# EasyEDA schematic Schemactic_LEDspot.json
TITLE: tiny_LEDspot; REV: 1.0; Date: 2019-06-21; Sheet: 1/1; Drawn By: julfi; Company: weldybox
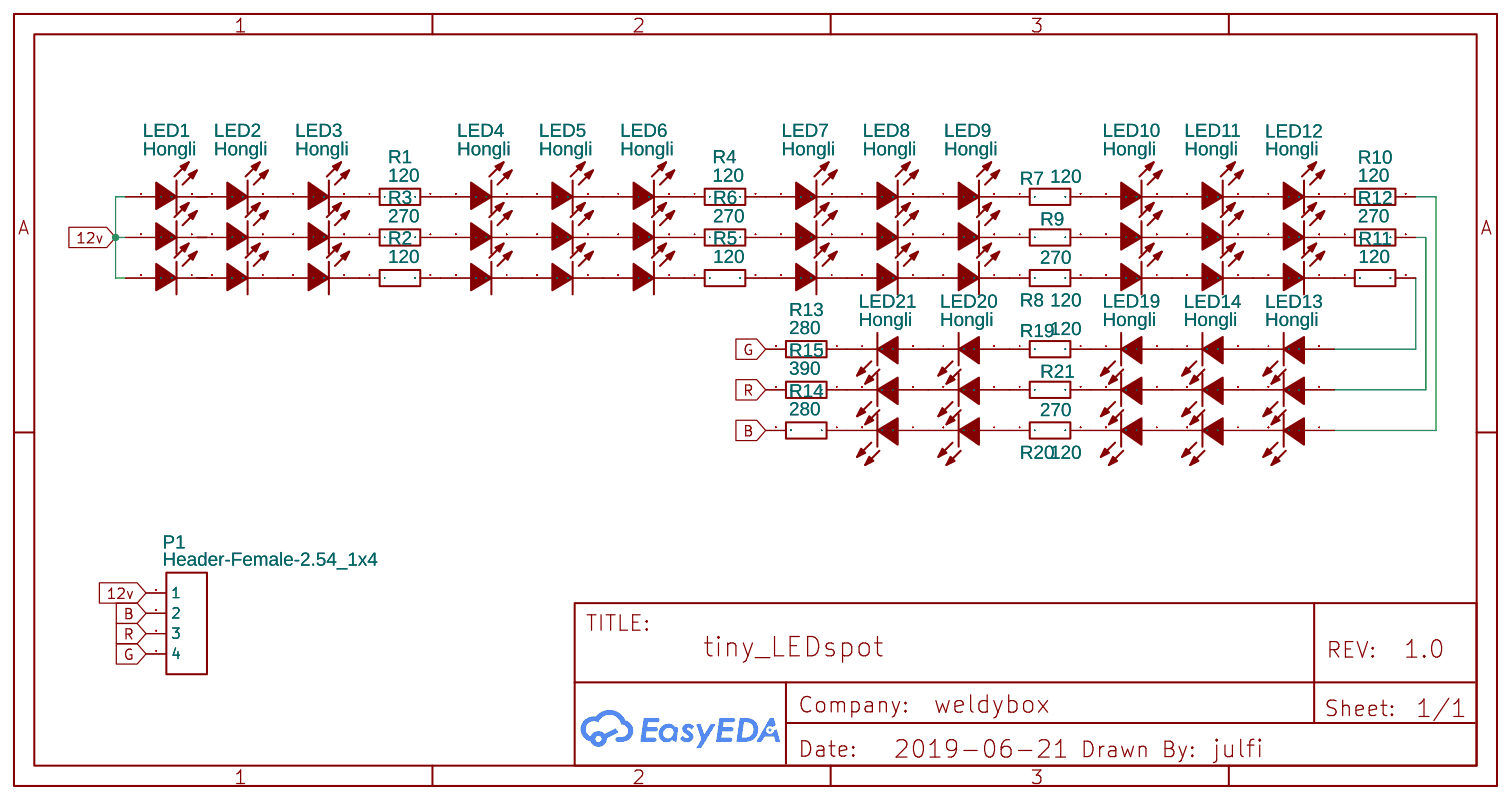
[diagram p0: schematic sheet]

## Parts
LED1  Hongli  [LED-SMD-5060]
LED2  Hongli  [LED-SMD-5060]
LED3  Hongli  [LED-SMD-5060]
LED4  Hongli  [LED-SMD-5060]
LED5  Hongli  [LED-SMD-5060]
LED6  Hongli  [LED-SMD-5060]
LED7  Hongli  [LED-SMD-5060]
LED8  Hongli  [LED-SMD-5060]
LED9  Hongli  [LED-SMD-5060]
LED10  Hongli  [LED-SMD-5060]
LED11  Hongli  [LED-SMD-5060]
LED12  Hongli  [LED-SMD-5060]
LED13  Hongli  [LED-SMD-5060]
LED14  Hongli  [LED-SMD-5060]
LED19  Hongli  [LED-SMD-5060]
LED20  Hongli  [LED-SMD-5060]
LED21  Hongli  [LED-SMD-5060]
P1  Header-Female-2.54_1x4  [HDR-4X1/2.54]
R1  120  [0805]
R2  120  [0805]
R3  270  [0805]
R4  120  [0805]
R5  120  [0805]
R6  270  [0805]
R7  120  [0805]
R8  120  [0805]
R9  270  [0805]
R10  120  [0805]
R11  120  [0805]
R12  270  [0805]
R13  280  [0805]
R14  280  [0805]
R15  390  [0805]
R19  120  [0805]
R20  120  [0805]
R21  270  [0805]

## Library data of the parts
LED1-LED14 LED19-LED21 = -: Supplier: LCSC; Supplier Part: C219409; Manufacturer: Hongli Zhihui (HONGLITRONIC); Manufacturer Part: HL-AF-5060H271BU46FU79GC-S1-THL; Contributor: LCSC
P1 = -: Supplier: LCSC; Manufacturer: ReliaPro; Supplier Part: C124413
R1 R2 R4 R5 R7 R8 R10 R11 R19 R20 = 0805W8J0121T5E: Supplier: LCSC; Manufacturer: UniOhm; Supplier Part: C25280
R3 R6 R9 R12 R21 = RS-05K271JT: Supplier: LCSC; Manufacturer: FH; Supplier Part: C115004
R13 R14 = 0805W8F2800T5E: Supplier: LCSC; Supplier Part: C247037; Manufacturer: Uniroyal Elec; Contributor: LCSC; LCSC Assembly: Yes; SMT Type: Extend
R15 = RTT053900FTP: Supplier: LCSC; Manufacturer: RALEC; Supplier Part: C104278

## Nets
12v: LED1.1(A) LED1.2(A) LED1.3(A) P1.1
B: P1.2 R14.2
G: P1.4 R13.2
R: P1.3 R15.2
Net-(LED1-4): LED1.4(C) LED2.3(A)
Net-(LED1-5): LED1.5(C) LED2.2(A)
Net-(LED1-6): LED1.6(C) LED2.1(A)
Net-(LED2-4): LED2.4(C) LED3.3(A)
Net-(LED2-5): LED2.5(C) LED3.2(A)
Net-(LED2-6): LED2.6(C) LED3.1(A)
Net-(LED3-4): LED3.4(C) R2.1
Net-(LED3-5): LED3.5(C) R3.1
Net-(LED3-6): LED3.6(C) R1.1
Net-(LED4-1): LED4.1(A) R1.2
Net-(LED4-2): LED4.2(A) R3.2
Net-(LED4-3): LED4.3(A) R2.2
Net-(LED4-4): LED4.4(C) LED5.3(A)
Net-(LED4-5): LED4.5(C) LED5.2(A)
Net-(LED4-6): LED4.6(C) LED5.1(A)
Net-(LED5-4): LED5.4(C) LED6.3(A)
Net-(LED5-5): LED5.5(C) LED6.2(A)
Net-(LED5-6): LED5.6(C) LED6.1(A)
Net-(LED6-4): LED6.4(C) R5.1
Net-(LED6-5): LED6.5(C) R6.1
Net-(LED6-6): LED6.6(C) R4.1
Net-(LED7-1): LED7.1(A) R4.2
Net-(LED7-2): LED7.2(A) R6.2
Net-(LED7-3): LED7.3(A) R5.2
Net-(LED7-4): LED7.4(C) LED8.3(A)
Net-(LED7-5): LED7.5(C) LED8.2(A)
Net-(LED7-6): LED7.6(C) LED8.1(A)
Net-(LED8-4): LED8.4(C) LED9.3(A)
Net-(LED8-5): LED8.5(C) LED9.2(A)
Net-(LED8-6): LED8.6(C) LED9.1(A)
Net-(LED9-4): LED9.4(C) R8.1
Net-(LED9-5): LED9.5(C) R9.1
Net-(LED9-6): LED9.6(C) R7.1
Net-(LED10-1): LED10.1(A) R7.2
Net-(LED10-2): LED10.2(A) R9.2
Net-(LED10-3): LED10.3(A) R8.2
Net-(LED10-4): LED10.4(C) LED11.3(A)
Net-(LED10-5): LED10.5(C) LED11.2(A)
Net-(LED10-6): LED10.6(C) LED11.1(A)
Net-(LED11-4): LED11.4(C) LED12.3(A)
Net-(LED11-5): LED11.5(C) LED12.2(A)
Net-(LED11-6): LED11.6(C) LED12.1(A)
Net-(LED12-4): LED12.4(C) R11.1
Net-(LED12-5): LED12.5(C) R12.1
Net-(LED12-6): LED12.6(C) R10.1
Net-(LED13-1): LED13.1(A) R10.2
Net-(LED13-2): LED13.2(A) R12.2
Net-(LED13-3): LED13.3(A) R11.2
Net-(LED13-4): LED13.4(C) LED14.3(A)
Net-(LED13-5): LED13.5(C) LED14.2(A)
Net-(LED13-6): LED13.6(C) LED14.1(A)
Net-(LED14-4): LED14.4(C) LED19.3(A)
Net-(LED14-5): LED14.5(C) LED19.2(A)
Net-(LED14-6): LED14.6(C) LED19.1(A)
Net-(LED19-4): LED19.4(C) R19.2
Net-(LED19-5): LED19.5(C) R21.2
Net-(LED19-6): LED19.6(C) R20.2
Net-(LED20-1): LED20.1(A) R20.1
Net-(LED20-2): LED20.2(A) R21.1
Net-(LED20-3): LED20.3(A) R19.1
Net-(LED20-4): LED20.4(C) LED21.3(A)
Net-(LED20-5): LED20.5(C) LED21.2(A)
Net-(LED20-6): LED20.6(C) LED21.1(A)
Net-(LED21-4): LED21.4(C) R13.1
Net-(LED21-5): LED21.5(C) R15.1
Net-(LED21-6): LED21.6(C) R14.1
